# EAGLE design untitled (EAGLE 9.6.0)
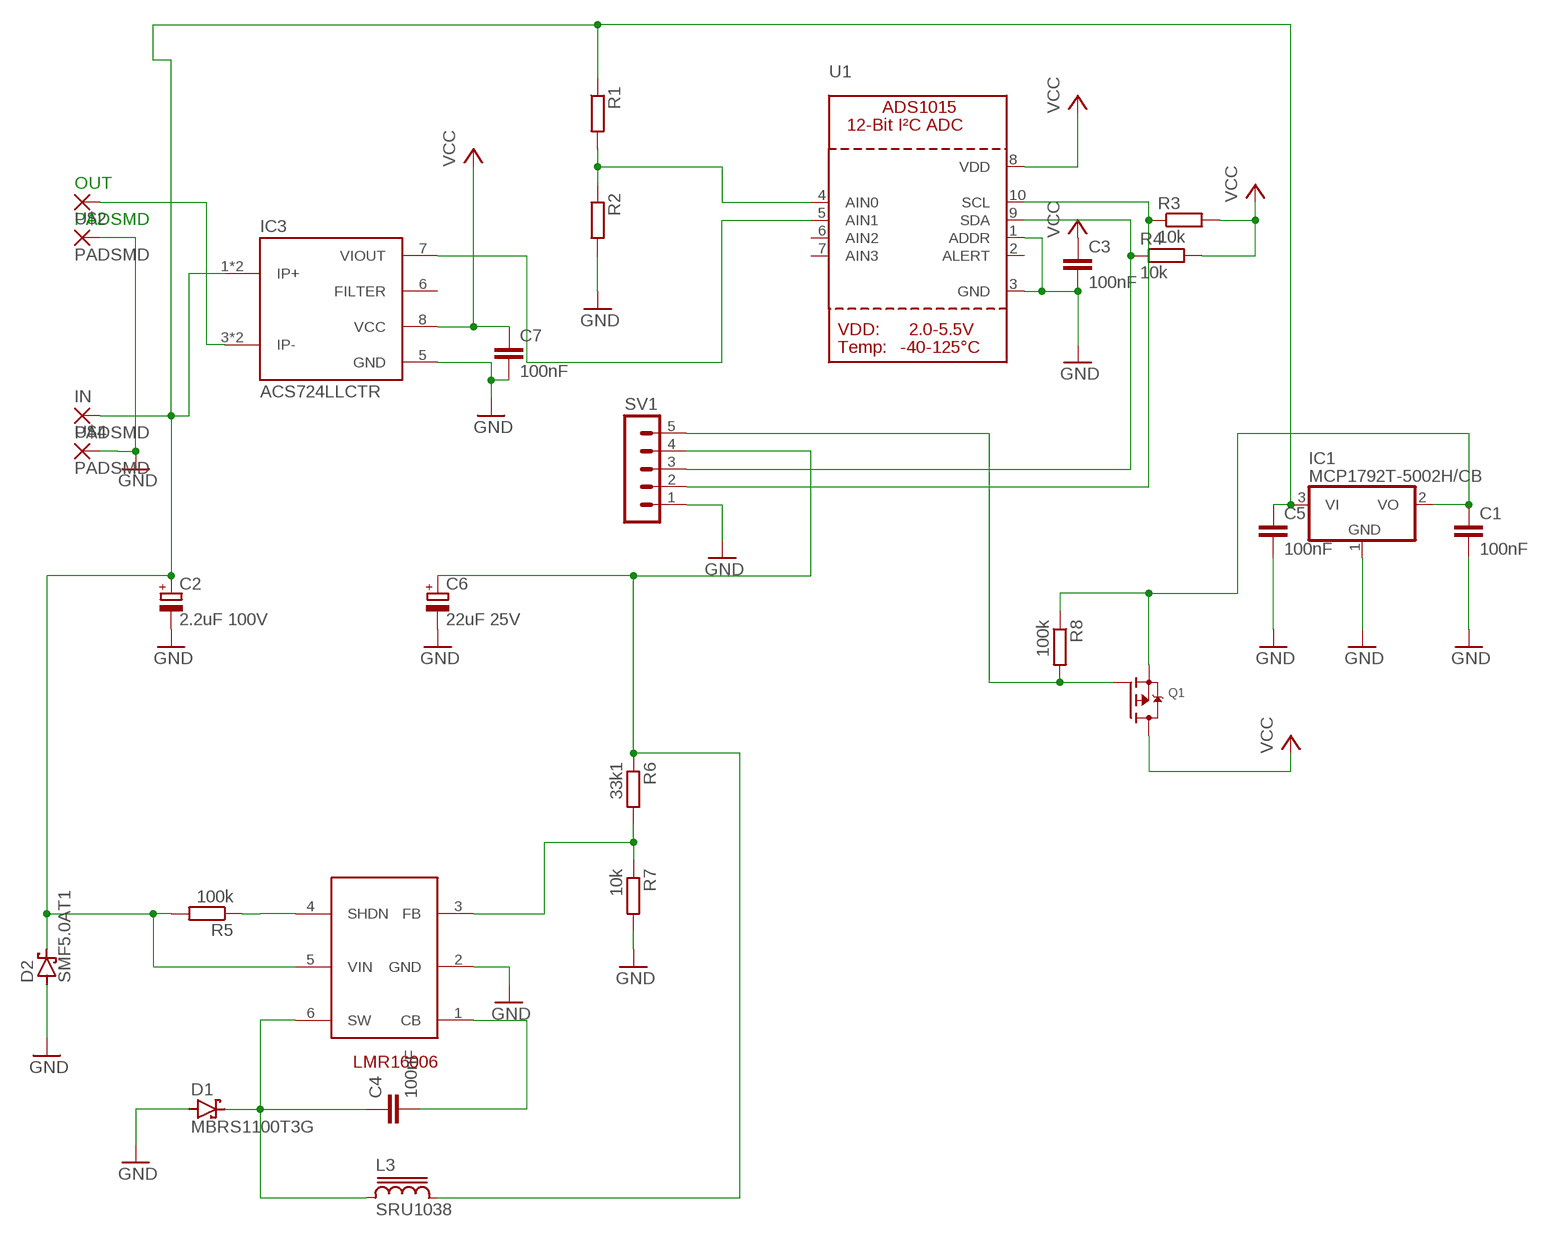
[diagram p0: schematic, sheet 1]

## Parts
C1  100nF  C-EUC0805  [C0805]
C2  2.2uF 100V  CPOL-EUB/3528-21R  [B/3528-21R]
C3  100nF  C-EUC0805  [C0805]
C4  100nF  C-EUC0805  [C0805]
C5  100nF  C-EUC0805  [C0805]
C6  22uF 25V  CPOL-EUR/2012-12R  [R/2012-12R]
C7  100nF  C-EUC0805  [C0805]
D1  MBRS1100T3G  BAT60J  [SOD323_ST]
D2  SMF5.0AT1  [SOD123FL]
IC1  MCP1792T-5002H/CB  MCP1703CB  [SOT23]
IC3  ACS724LLCTR  [SO08]
IN  PADSMD  [PADS]
L3  SRU1038  [SRU1038]
OUT  PADSMD  [PADS]
Q1  MOSFET-PWIDE  [SOT23-WIDE]
R1  R-EU_R0805  [R0805]
R2  R-EU_R0805  [R0805]
R3  10k  R-EU_R0805  [R0805]
R4  10k  R-EU_R0805  [R0805]
R5  100k  R-EU_M0805  [M0805]
R6  33k1  R-EU_M0805  [M0805]
R7  10k  R-EU_M0805  [M0805]
R8  100k  R-EU_R0805  [R0805]
SV1  MA05-1  [MA05-1]
U1  ADC_ADS1015  [MSOP10]
U$2  PADSMD  [PADS]
U$4  PADSMD  [PADS]
U$5  LMR16006  [TSOT23-6_DDC]

## Nets
GND: C1.2 C2.- C3.2 C5.2 C6.- C7.2 D1.A D2.A IC1.1(GND) IC3.5(GND) R2.2 R7.2 SV1.1 U1.1(ADDR) U1.3(GND) U$2.P$1(P) U$4.P$1(P) U$5.2(GND)
N$1: IC3.7(VIOUT) U1.5(AIN1)
N$2: IC3.3(IP-) IC3.4(IP-) OUT.P$1(P)
N$3: R5.1 U$5.4(SHDN)
N$4: C2.+ C5.1 D2.C IC1.3(VI) IC3.1(IP+) IC3.2(IP+) IN.P$1(P) R1.1 R5.2 U$5.5(VIN)
N$5: R4.1 SV1.3 U1.9(SDA)
N$6: R3.1 SV1.2 U1.10(SCL)
N$7: Q1.1(G) R8.2 SV1.5
N$8: C6.+ L3.2 R6.1 SV1.4
N$9: C4.1 D1.C L3.1 U$5.6(SW)
N$10: C4.2 U$5.1(CB)
N$11: R6.2 R7.1 U$5.3(FB)
N$12: C1.1 IC1.2(VO) Q1.2(S) R8.1
N$13: R1.2 R2.1 U1.4(AIN0)
VCC: C3.1 C7.1 IC3.8(VCC) Q1.3(D) R3.2 R4.2 U1.8(VDD)
Unconnected: IC3.6(FILTER) U1.2(ALERT) U1.6(AIN2) U1.7(AIN3)

## Library data of the parts
C1 C3-C5 C7 = rcl:C-EU: CAPACITOR, European symbol; SPICEPREFIX: C
C2 C6 = rcl:CPOL-EU: POLARIZED CAPACITOR, European symbol; SPICEPREFIX: C
D1 = diode:BAT60J: Schottky barrier diode Source: www.st.com, BAT60J.pdf
D2 = diode:SMF5.0AT1: 200 W Transient Voltage Suppressor Source: Data sheet <http://www.onsemi.com/pub_link/Collateral/SMF5.0AT1-D.PDF>
IC1 = linear:MCP1703: 250 mA, 16V, Low Quiescent Current LDO Regulator Source: http://ww1.microchip.com/downloads/en/DeviceDoc/22049b.pdf
IC3 = we-sensor:ACS724: Allegro ACS724/ACS725 Hall Effect Current Sensor ACS724 VCC=5V, ACS725 VCC=3.3V -05AB-T +/-5A -10AU-T 10A -10AB-T +/-10A -20AU-T 20A -20AB-T +/-20A -30AU-T 30A -30AB-T +/-30A -50AB-T +/-50A
IN OUT U$2 U$4 = wirepad:PAD
L3 = inductor-bourns:SRU1038: POWER INDUCTOR
Q1 = microbuilder:MOSFET-P: P-Channel Mosfet LEGEND VDS: Voltage Drain-Source ID: Drain Current RDS(ON): Drain-Source On-State Resistance VGS(TH): Gate-Source Threshold Voltage CISS: Drain-Source Input Capacitance SOT-23 Name VDS ID RDS(ON) VGS(TH) CISS Order Number IRLML5103 30V 760mA 600 mOhm -- 75pF @ 25V Digikey: IRLML5103PBFCT-ND IRLML6401 12V 4.3A 50 mOhm 950mV @ 250µA 830pF @ 10V Digikey: IRLML6401PBFTR-ND NTR0202PL 20V 400mA 800 mOhm 2.3V @ 250uA 70pF @ 5V Digikey: NTR0202PLT1GOSTR-ND NTR4101PT1G 20V 1.8A 85 mOhm 1.2V @ 250uA 675pF @ 10V Digikey: NTR4101PT1GOSCT-ND DMP2004K 20V 600mA 900 mOhm 1V @ 250uA 175pF @ 16V Digikey: DMP2004KDICT-ND PMV65XP 20V 3.9A 76 mOhm 950mV @ 1mA 725pF @ 20V Digikey: 568-2358-2-ND TO-252 Name VDS ID RDS(ON) VGS(TH) CISS Order Number AOD417 30V 25A 34 mOhm 3V @ 250µA 920pF @ 15V Digikey: 785-1106-2-ND
R1-R8 = rcl:R-EU_: RESISTOR, European symbol; SPICEPREFIX: R
SV1 = con-lstb:MA05-1: PIN HEADER; OC_FARNELL: unknown; OC_NEWARK: unknown
U1 = microbuilder:ADC_ADS1015: ADS1015 - 12-bit 4-Channel I2C ADC with Internal PGA VDD: 2.0-5.5V Sampling Rate: 3.3ksps Gain Settings: 2/3, 1, 2, 4, 8, 16 I2C Address: ADDR low = 1001000x, ADDR high = 1001001x Internal Comparator The ADS1015 includes an internal comparator that can be set to output a high-level on ALERT when the conversion results exceeeds a pre-defined upper level, and will deassert itself when the level falls below a pre-defined lower threshold level. It can also be set to windowed mode where the ALERT pin will be asserted if the data exceeds the upper threshold or falls below the lower threshold.
U$5 = texas:LMR16006

## Board
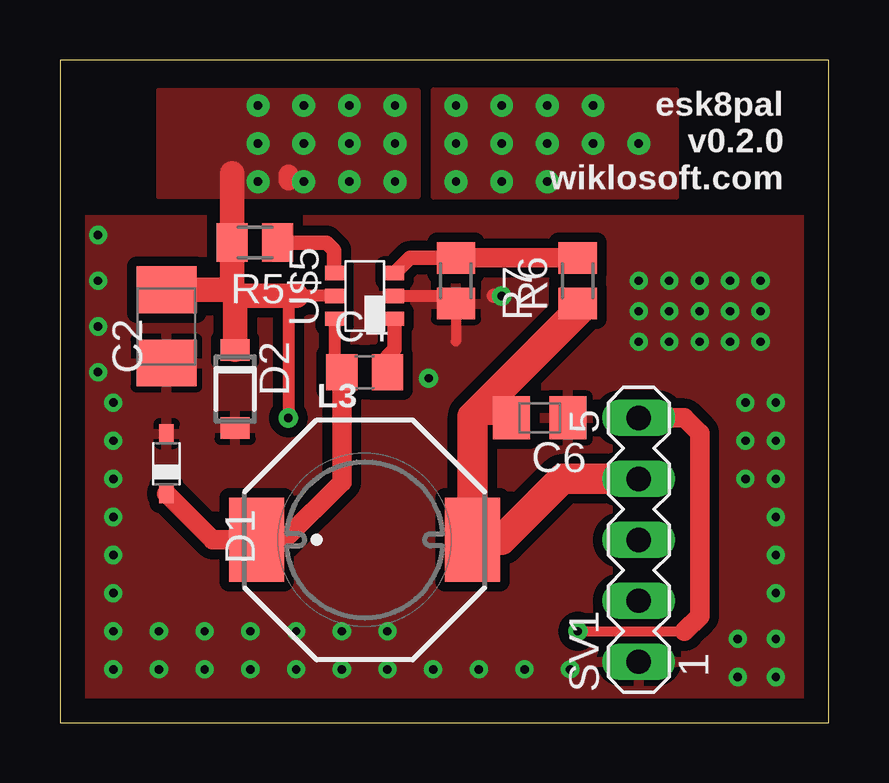
[diagram p1: board, top side]
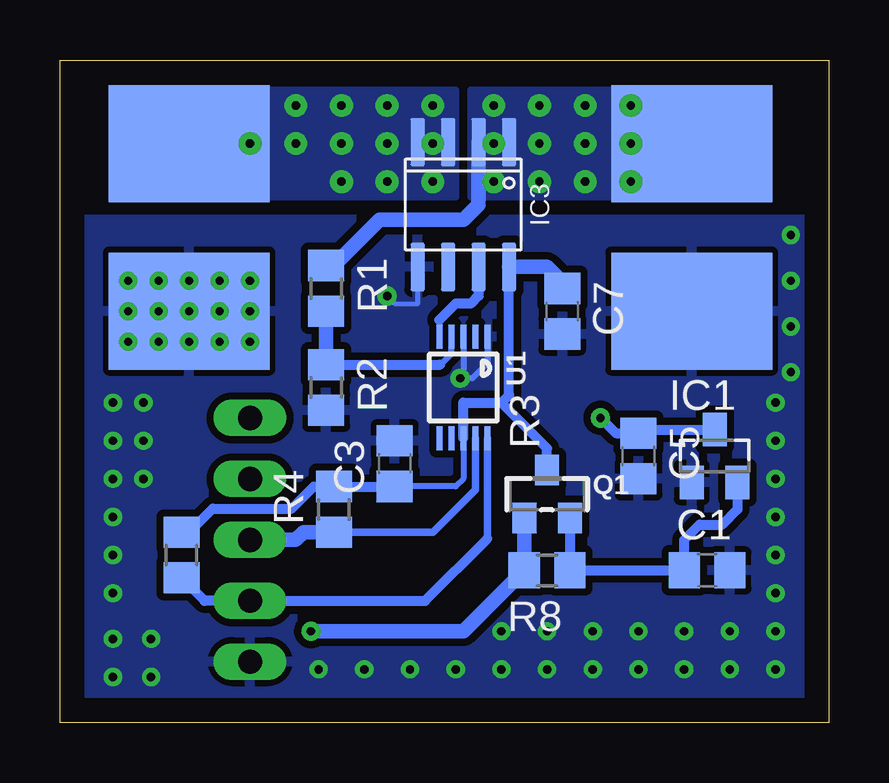
[diagram p2: board, bottom side, seen from below]

Size 32.05 x 27.61 mm. Coordinates in mm from the lower left corner, seen from the top.
Outline: 0,0 32.05,0 32.05,27.61 0,27.61 0,0
Copper layers (1*16): Top 0.035mm / dielectric 1.5mm / Bottom 0.035mm
Design rules "default": minimum track width 6mil, minimum drill 0.35mm, track to track 6mil, track to pad 6mil, pad to pad 6mil, via to via 6mil, smd to smd 6mil, copper to edge 40mil, drill to drill 6mil, minimum pad ring 10mil, minimum via ring 8mil, stop-mask expansion 4mil, vias tented up to drill 0mil, thermal gap 10mil

### Footprints (pad centres in the part's own frame; a part is rotated, then mirrored left to right if it is on the bottom)
C0805 = smd 1.3 x 1.5: 1 -0.95,0; 2 0.95,0
B/3528-21R = smd 1.95 x 2.5: + 1.525,0; - -1.525,0
R/2012-12R = smd 1.55 x 1.8: + 1.175,0; - -1.175,0
SOD323_ST = smd 0.8 x 0.6: A 1.25,0; C -1.25,0
SOD123FL = smd 0.91 x 1.22: A 1.625,0; C -1.625,0
SOT23 = smd 1 x 1.4: 1 -0.95,-1.1; 2 0.95,-1.1; 3 0,1.1
SO08 = smd 2 x 0.6: 1 -2.6,1.905; 2 -2.6,0.635; 3 -2.6,-0.635; 4 -2.6,-1.905; 5 2.6,-1.905; 6 2.6,-0.635; 7 2.6,0.635; 8 2.6,1.905
PADS = smd 6.706 x 4.877: P$1 0,0
SRU1038 = smd 2.308 x 3.5: 1 -4.5,0; 2 4.5,0
SOT23-WIDE = smd 1 x 1.27: 1 -0.95,-1; 2 0.95,-1; 3 0,1
R0805 = smd 1.3 x 1.5: 1 -0.95,0; 2 0.95,0
M0805 = smd 1.3 x 1.6: 1 -0.95,0; 2 0.95,0
MA05-1 = drill 1.016 long: 1 -5.08,0; 2 -2.54,0; 3 0,0; 4 2.54,0; 5 5.08,0
MSOP10 = smd 0.25 x 1: 1 -1,-2.113; 2 -0.5,-2.113; 3 0,-2.113; 4 0.5,-2.113; 5 1,-2.113; 6 1,2.113; 7 0.5,2.113; 8 0,2.113; 9 -0.5,2.113; 10 -1,2.113
TSOT23-6_DDC = smd 0.6 x 0.8: 1 -0.95,-1.25; 2 0,-1.25; 3 0.95,-1.25; 4 0.95,1.25; 5 0,1.25; 6 -0.95,1.25

### Placement (x,y rotation side)
C1  5.08,6.35 0 bottom
C2  4.45,16.51 90 top
C3  18.1,10.79 90 bottom
C4  12.7,14.6 0 top
C5  7.94,11.11 270 bottom
C6  20,12.7 180 top
C7  11.11,17.14 270 bottom
D1  4.45,10.79 90 top
D2  7.3,13.91 270 top
IC1  4.76,11.11 0 bottom
IC3  15.24,21.59 270 bottom
IN  5.71,24.13 0 bottom
L3  12.7,7.62 0 top
OUT  26.67,24.13 0 bottom
Q1  11.75,9.53 0 bottom
R1  20.95,18.1 270 bottom
R2  20.95,13.97 270 bottom
R3  26.99,6.99 90 bottom
R4  20.64,8.89 90 bottom
R5  8.13,20 180 top
R6  21.59,18.41 90 top
R7  16.51,18.41 270 top
R8  11.75,6.35 180 bottom
SV1  24.13,7.62 90 top
U1  15.24,13.97 180 bottom
U$2  5.71,17.14 180 bottom
U$4  26.67,17.14 0 bottom
U$5  12.7,17.78 90 top

### Tracks (layer width: path | path; a pad name or v marks a point on that pad's centre or on a via)
GND  (via drill 0.35, 0.35 pad 0.8)
  Top 0.406: R7.2 16.51,15.87
  Top 0.508: U$5.2 16.2,17.78 R7.2
  Top 0.61: v18.41,17.78 18.1,17.78
  Bottom 0.203: IC3.5 17.15,17.46 18.1,17.46 v18.41,17.78
  Bottom 0.254: U1.1 14.24,14.97 14.86,14.35 v15.37,14.35 15.24,14.48 U1.3
  other vias: 2.22,2.22 4.13,2.22 6.03,2.22 24.13,18.41 25.4,18.41 26.67,18.41 27.94,18.41 29.21,18.41 29.21,17.14 29.21,15.87 27.94,15.87 27.94,17.14 26.67,17.14 26.67,15.87 25.4,15.87 25.4,17.14 24.13,17.14 24.13,15.87 7.94,2.22 9.84,2.22 11.75,2.22 13.65,2.22 15.56,2.22 17.46,2.22 19.37,2.22 21.27,2.22 28.26,1.9 28.26,3.49 29.84,3.49 29.84,1.9 29.84,13.33 29.84,11.75 28.58,11.75 28.58,13.33 1.59,20.32 1.59,18.41 1.59,16.51 1.59,14.6 2.22,11.75 2.22,10.16 2.22,8.57 2.22,6.99 2.22,3.81 4.13,3.81 6.03,3.81 7.94,3.81 9.84,3.81 11.75,3.81 13.65,3.81 2.22,5.4 2.22,13.33 29.84,10.16 29.84,8.57 29.84,6.99 28.58,10.16 29.84,5.4
  pour Top (isolate 0.406): -0.63,20.95 41.91,20.95 41.91,0 -0.63,0
  pour Bottom (isolate 0.305): 0.64,20.95 41.91,20.95 41.91,-1.27 0.64,-1.27
N$1
  Bottom 0.254: IC3.7 14.61,18.41 | 16.24,16.78 U1.5
  Bottom 0.406: IC3.7 14.61,17.78 14.92,17.46 15.56,17.46 16.24,16.78
N$2  (via drill 0.35 pad 0.95)
  Bottom 0.406: 26.61,24.19 OUT.P$1
  other vias: 22.23,25.72 24.13,24.13 22.23,24.13 20.32,22.54 20.32,24.13 20.32,25.72 18.41,25.72 18.41,24.13 18.41,22.54 16.51,22.54 16.51,24.13 16.51,25.72
  pour Bottom (no thermals): 23.81,26.35 15.56,26.35 15.56,21.91 23.81,21.91
  pour Top: 15.56,26.35 15.56,21.91 25.72,21.91 25.72,26.35
N$3
  Top 0.61: U$5.4 11.43,18.75 11.43,19.68 11.11,20 R5.1
N$4  (via drill 0.35 pad 0.8, 0.35 pad 0.95)
  Top 0.508: v9.52,12.7 9.52,17.44 9.86,17.78 U$5.5 | 7.17,18.03 7.3,17.91 7.3,17.78 | 7.31,17.78 7.3,17.78 | 7.3,17.78 7.18,17.91
  Top 0.813: 9.52,22.86 9.52,22.58 | R5.2 7.14,20
  Top 1.016: 7.18,22.9 R5.2 | C2.+ 7.17,18.03 | 7.3,17.78 D2.C | R5.2 7.18,17.91 | 9.86,17.78 7.31,17.78
  Bottom 0.305: IC3.1 13.27,24.13
  Bottom 0.406: v9.52,12.7 8.89,12.06 C5.1 7.79,12.21 IC1.3
  Bottom 0.61: R1.1 20.64,19.05 18.73,20.95 15.24,20.95 14.61,21.59 IC3.2
  other vias: 13.97,25.72 13.97,24.13 13.97,22.54 12.07,22.54 12.07,24.13 12.07,25.72 10.16,25.72 10.16,24.13 10.16,22.54 8.25,22.54 8.25,24.13 8.25,25.72
  pour Bottom (isolate 0.406, no thermals): 8.57,26.35 14.92,26.35 14.92,21.91 8.57,21.91
  pour Top: 14.92,26.35 14.92,21.91 4.13,21.91 4.13,26.03 4.13,26.35
N$5
  Bottom 0.305: U1.9 14.74,9.71 16.51,7.94 R4.1
  Bottom 0.406: R4.1
  Bottom 0.61: R4.1 21.91,7.94 22.23,7.62 SV1.3
N$6
  Bottom 0.305: 14.24,7.67 U1.10
  Bottom 0.406: R3.1 26.03,5.08 SV1.2 16.83,5.08 14.24,7.67
N$7  (via drill 0.35 pad 0.8)
  Top 0.406: v21.59,3.81 26.03,3.81
  Top 0.813: 26.03,3.81 26.67,4.44 26.67,12.06 26.03,12.7 SV1.5
  Bottom 0.61: v21.59,3.81 15.24,3.81 R8.2 Q1.1
N$8
  Top 0.61: 17.17,7.65 L3.2 | C6.+ 17.2,12.7
  Top 1.27: R6.1 21.59,17.14 17.2,12.76 17.2,12.7 L3.2 18.41,7.62 20.95,10.16 SV1.4
N$9
  Top 0.508: C4.1 11.45,14.9 U$5.6
  Top 0.813: C4.1 11.75,10.03 9.34,7.62 L3.1 6.37,7.62 D1.C
  Top 1.27: 8.25,7.67 L3.1
N$10
  Top 0.61: U$5.1 13.95,15.56 13.65,15.26 C4.2
N$11
  Top 0.61: R7.1 14.59,19.36 U$5.3
  Top 0.813: R7.1 R6.2
N$12
  Bottom 0.406: IC1.2 3.81,8.89 4.45,8.26 5.4,8.26 6.03,7.62 C1.1 R8.1 Q1.2
N$13
  Bottom 0.254: 16.2,14.92 15.74,15.37 U1.4
  Bottom 0.406: R1.2 20.63,17.14 | R2.1 16.2,14.92
  Bottom 0.61: R1.2 R2.1
VCC
  Bottom 0.254: U1.8 15.24,10.16 15.56,9.84 C3.1 17.78,10.16
  Bottom 0.406: U1.8 15.24,13.33 13.65,13.33 | IC3.8 13.34,13.65 13.65,13.33 | C3.1 R4.2 21.47,9.84 22.4,8.92 25.69,8.92 26.67,7.94 R3.2 | Q1.3 11.75,11.43 13.65,13.33
  Bottom 0.61: IC3.8 11.75,18.99 11.11,18.35 C7.1

### Text on the board
tNames: esk8pal / v0.2.0 / wiklosoft.com